# EAGLE schematic ManualBot_Shield (EAGLE 9.2.0)
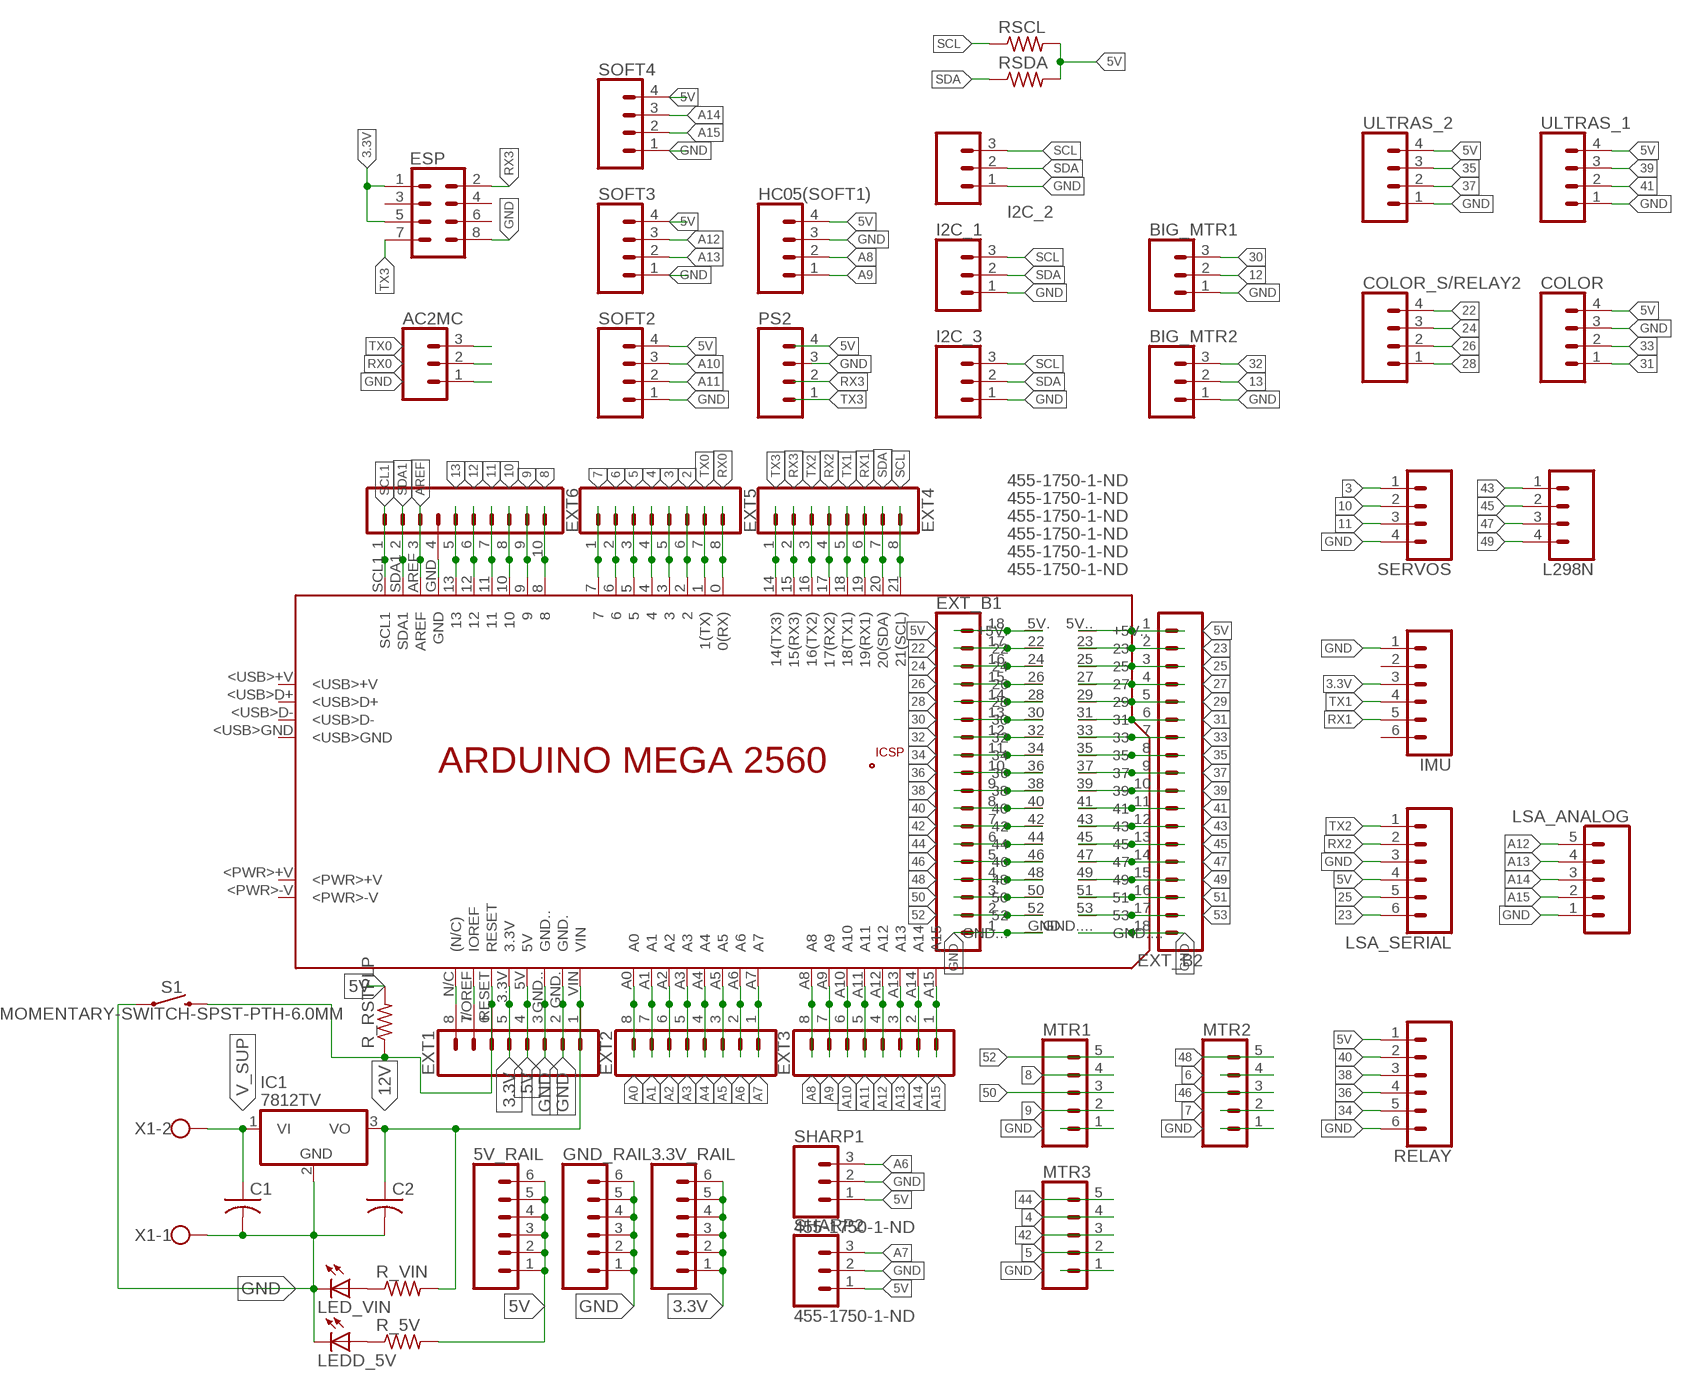
[diagram p0: schematic, sheet 1]

## Parts
3.3V_RAIL  CONN_06SILK_FEMALE_PTH  [1X06]
5V_RAIL  CONN_06SILK_FEMALE_PTH  [1X06]
AC2MC  455-1750-1-ND  CONN_03  [1X03]
BIG_MTR1  455-1750-1-ND  CONN_03  [1X03]
BIG_MTR2  455-1750-1-ND  CONN_03  [1X03]
C1  C-US025-024X044  [C025-024X044]
C2  C-US025-024X044  [C025-024X044]
COLOR  CONN_04  [1X04]
COLOR_S/RELAY2  CONN_04  [1X04]
ESP  CONN_04X2  [2X4]
EXT1  CONN_08"  [1X08]
EXT2  CONN_08"  [1X08]
EXT3  CONN_08"  [1X08]
EXT4  CONN_08"  [1X08]
EXT5  CONN_08"  [1X08]
EXT6  CONN_10"  [1X10]
EXT_B1  CONN_18  [1X18_NO_SILK]
EXT_B2  CONN_18  [1X18_NO_SILK]
GND_RAIL  CONN_06SILK_FEMALE_PTH  [1X06]
HC05(SOFT1)  CONN_04  [1X04]
I2C_1  455-1750-1-ND  CONN_03  [1X03]
I2C_2  455-1750-1-ND  CONN_03  [1X03]
I2C_3  455-1750-1-ND  CONN_03  [1X03]
IC1  7812TV  [TO220V]
IMU  CONN_06SILK_FEMALE_PTH  [1X06]
L298N  CONN_04  [1X04]
LED_VIN  LED5MM  [LED5MM]
LEDD_5V  LED5MM  [LED5MM]
LSA_ANALOG  CONN_05  [1X05]
LSA_SERIAL  CONN_06SILK_FEMALE_PTH  [1X06]
MTR1  CONN_05  [1X05]
MTR2  CONN_05  [1X05]
MTR3  CONN_05  [1X05]
PCB1  ARDUINO_MEGA2560  [ARDUINO_MEGA2560]
PS2  CONN_04  [1X04]
R_5V  R-US_0204/7  [0204/7]
R_RSTPLP  R-US_0204/7  [0204/7]
R_VIN  R-US_0204/7  [0204/7]
RELAY  CONN_06SILK_FEMALE_PTH  [1X06]
RSCL  R-US_0204/7  [0204/7]
RSDA  R-US_0204/7  [0204/7]
S1  MOMENTARY-SWITCH-SPST-PTH-6.0MM  [TACTILE_SWITCH_PTH_6.0MM]
SERVOS  CONN_04  [1X04]
SHARP1  455-1750-1-ND  CONN_03  [1X03]
SHARP2  455-1750-1-ND  CONN_03  [1X03]
SOFT2  CONN_04  [1X04]
SOFT3  CONN_04  [1X04]
SOFT4  CONN_04  [1X04]
ULTRAS_1  CONN_04  [1X04]
ULTRAS_2  CONN_04  [1X04]
X1  W237-102  [W237-102]

## Nets
2: EXT5.6 PCB1.2
3: EXT5.5 PCB1.3 SERVOS.1
3.3V: 3.3V_RAIL.1 3.3V_RAIL.2 3.3V_RAIL.3 3.3V_RAIL.4 3.3V_RAIL.5 3.3V_RAIL.6 ESP.1 ESP.5 EXT1.5 IMU.3 PCB1.3.3V
4: EXT5.4 MTR3.4 PCB1.4
5: EXT5.3 MTR3.2 PCB1.5
5V: 5V_RAIL.1 5V_RAIL.2 5V_RAIL.3 5V_RAIL.4 5V_RAIL.5 5V_RAIL.6 COLOR.4 EXT1.4 EXT_B1.18 EXT_B2.1 HC05(SOFT1).4 LSA_SERIAL.4 PCB1.5V PCB1.5V.(+5V.) PCB1.5V..(+5V..) PS2.4 R_5V.2 R_RSTPLP.2 RELAY.1 RSCL.2 RSDA.2 SHARP1.1 SHARP2.1 SOFT2.4 SOFT3.4 SOFT4.4 ULTRAS_1.4 ULTRAS_2.4
6: EXT5.2 MTR2.4 PCB1.6
7: EXT5.1 MTR2.2 PCB1.7
8: EXT6.10 MTR1.4 PCB1.8
9: EXT6.9 MTR1.2 PCB1.9
10: EXT6.8 PCB1.10 SERVOS.2
11: EXT6.7 PCB1.11 SERVOS.3
12: BIG_MTR1.2 EXT6.6 PCB1.12
12V: C2.1 EXT1.1 IC1.3(VO) PCB1.VIN R_VIN.2
13: BIG_MTR2.2 EXT6.5 PCB1.13
22: COLOR_S/RELAY2.4 EXT_B1.17 PCB1.22
23: EXT_B2.2 LSA_SERIAL.6 PCB1.23
24: COLOR_S/RELAY2.3 EXT_B1.16 PCB1.24
25: EXT_B2.3 LSA_SERIAL.5 PCB1.25
26: COLOR_S/RELAY2.2 EXT_B1.15 PCB1.26
27: EXT_B2.4 PCB1.27
28: COLOR_S/RELAY2.1 EXT_B1.14 PCB1.28
29: EXT_B2.5 PCB1.29
30: BIG_MTR1.3 EXT_B1.13 PCB1.30
31: COLOR.1 EXT_B2.6 PCB1.31
32: BIG_MTR2.3 EXT_B1.12 PCB1.32
33: COLOR.2 EXT_B2.7 PCB1.33
34: EXT_B1.11 PCB1.34 RELAY.5
35: EXT_B2.8 PCB1.35 ULTRAS_2.3
36: EXT_B1.10 PCB1.36 RELAY.4
37: EXT_B2.9 PCB1.37 ULTRAS_2.2
38: EXT_B1.9 PCB1.38 RELAY.3
39: EXT_B2.10 PCB1.39 ULTRAS_1.3
40: EXT_B1.8 PCB1.40 RELAY.2
41: EXT_B2.11 PCB1.41 ULTRAS_1.2
42: EXT_B1.7 MTR3.3 PCB1.42
43: EXT_B2.12 L298N.1 PCB1.43
44: EXT_B1.6 MTR3.5 PCB1.44
45: EXT_B2.13 L298N.2 PCB1.45
46: EXT_B1.5 MTR2.3 PCB1.46
47: EXT_B2.14 L298N.3 PCB1.47
48: EXT_B1.4 MTR2.5 PCB1.48
49: EXT_B2.15 L298N.4 PCB1.49
50: EXT_B1.3 MTR1.3 PCB1.50
51: EXT_B2.16 PCB1.51
52: EXT_B1.2 MTR1.5 PCB1.52
53: EXT_B2.17 PCB1.53
A0: EXT2.8 PCB1.A0
A1: EXT2.7 PCB1.A1
A2: EXT2.6 PCB1.A2
A3: EXT2.5 PCB1.A3
A4: EXT2.4 PCB1.A4
A5: EXT2.3 PCB1.A5
A6: EXT2.2 PCB1.A6 SHARP1.3
A7: EXT2.1 PCB1.A7 SHARP2.3
A8: EXT3.8 HC05(SOFT1).2 PCB1.A8
A9: EXT3.7 HC05(SOFT1).1 PCB1.A9
A10: EXT3.6 PCB1.A10 SOFT2.3
A11: EXT3.5 PCB1.A11 SOFT2.2
A12: EXT3.4 LSA_ANALOG.5 PCB1.A12 SOFT3.3
A13: EXT3.3 LSA_ANALOG.4 PCB1.A13 SOFT3.2
A14: EXT3.2 LSA_ANALOG.3 PCB1.A14 SOFT4.3
A15: EXT3.1 LSA_ANALOG.2 PCB1.A15 SOFT4.2
AREF: EXT6.3 PCB1.AREF
GND: AC2MC.1 BIG_MTR1.1 BIG_MTR2.1 C1.2 C2.2 COLOR.3 ESP.8 EXT1.2 EXT1.3 EXT6.4 EXT_B1.1 EXT_B2.18 GND_RAIL.1 GND_RAIL.2 GND_RAIL.3 GND_RAIL.4 GND_RAIL.5 GND_RAIL.6 HC05(SOFT1).3 I2C_1.1 I2C_2.1 I2C_3.1 IC1.2(GND) IMU.1 LED_VIN.K(C) LEDD_5V.K(C) LSA_ANALOG.1 LSA_SERIAL.3 MTR1.1 MTR2.1 MTR3.1 PCB1.GND PCB1.GND. PCB1.GND.. PCB1.GND... PCB1.GND.... PS2.3 RELAY.6 S1.1 SERVOS.4 SHARP1.2 SHARP2.2 SOFT2.1 SOFT3.1 SOFT4.1 ULTRAS_1.1 ULTRAS_2.1 X1.1
N$4: LED_VIN.A R_VIN.1
N$5: LEDD_5V.A R_5V.1
N$55: EXT1.6 PCB1.RESET R_RSTPLP.1 S1.3
N$61: EXT1.7 PCB1.I/OREF(IOREF)
N$62: EXT1.8 PCB1.N/C((N/C))
RX0: AC2MC.2 EXT5.8 PCB1.0(0(RX))
RX1: EXT4.6 IMU.5 PCB1.19(19(RX1))
RX2: EXT4.4 LSA_SERIAL.2 PCB1.17(17(RX2))
RX3: ESP.2 EXT4.2 PCB1.15(15(RX3)) PS2.2
SCL: EXT4.8 I2C_1.3 I2C_2.3 I2C_3.3 PCB1.21(21(SCL)) RSCL.1
SCL1: EXT6.1 PCB1.SCL1
SDA: EXT4.7 I2C_1.2 I2C_2.2 I2C_3.2 PCB1.20(20(SDA)) RSDA.1
SDA1: EXT6.2 PCB1.SDA1
TX0: AC2MC.3 EXT5.7 PCB1.1(1(TX))
TX1: EXT4.5 IMU.4 PCB1.18(18(TX1))
TX2: EXT4.3 LSA_SERIAL.1 PCB1.16(16(TX2))
TX3: ESP.7 EXT4.1 PCB1.14(14(TX3)) PS2.1
V_SUP: C1.1 IC1.1(VI) X1.2
Unconnected: ESP.3 ESP.4 ESP.6 IMU.2 IMU.6 PCB1.+5V_ PCB1.<PWR>+V PCB1.<PWR>-V PCB1.<USB>+V PCB1.<USB>D+ PCB1.<USB>D- PCB1.<USB>GND PCB1.GND__ PCB1.MISO PCB1.MOSI PCB1.RESET. PCB1.SCK

## Library data of the parts
3.3V_RAIL 5V_RAIL GND_RAIL IMU LSA_SERIAL RELAY = SparkFun-Connectors:CONN_06: Multi connection point. Often used as Generic Header-pin footprint for 0.1 inch spaced/style header connections On any of the 0.1 inch spaced packages, you can populate with these: Break Away Headers - Straight <https://www.sparkfun.com/products/116> (PRT-00116) Break Away Male Headers - Right Angle <https://www.sparkfun.com/products/553> (PRT-00553) Female Headers <https://www.sparkfun.com/products/115> (PRT-00115) Break Away Headers - Machine Pin <https://www.sparkfun.com/products/117> (PRT-00117) Break Away Female Headers - Swiss Machine Pin <https://www.sparkfun.com/products/743> (PRT-00743) Arduino Stackable Header - 6 Pin <https://www.sparkfun.com/products/9280> (PRT-09280) For SCREWTERMINALS and SPRING TERMINALS visit here: Screw Terimnals on SparkFun.com <https://www.sparkfun.com/search/results?term=Screw+Terminals> (5mm/3.5mm/2.54mm spacing) This device is also useful as a general connection point to wire up your design to another part of your project. Our various solder wires solder well into these plated through hole pads. Hook-Up Wire - Assortment (Stranded, 22 AWG) <https://www.sparkfun.com/products/11375> (PRT-11375) Hook-Up Wire - Assortment (Solid Core, 22 AWG) <https://www.sparkfun.com/products/11367> (PRT-11367) View the entire wire category on our website here <https://www.sparkfun.com/categories/141>; PROD_ID: CONN-08437
AC2MC BIG_MTR1 BIG_MTR2 I2C_1-I2C_3 SHARP1 SHARP2 = SparkFun-Connectors:CONN_03: Multi connection point. Often used as Generic Header-pin footprint for 0.1 inch spaced/style header connections On any of the 0.1 inch spaced packages, you can populate with these: Break Away Headers - Straight <https://www.sparkfun.com/products/116> (PRT-00116) Break Away Male Headers - Right Angle <https://www.sparkfun.com/products/553> (PRT-00553) Female Headers <https://www.sparkfun.com/products/115> (PRT-00115) Break Away Headers - Machine Pin <https://www.sparkfun.com/products/117> (PRT-00117) Break Away Female Headers - Swiss Machine Pin <https://www.sparkfun.com/products/743> (PRT-00743) Stackable Header - 3 Pin (Female, 0.1") <https://www.sparkfun.com/products/13875> (PRT-13875) For SCREWTERMINALS and SPRING TERMINALS visit here: Screw Terimnals on SparkFun.com <https://www.sparkfun.com/search/results?term=Screw+Terminals> (5mm/3.5mm/2.54mm spacing) This device is also useful as a general connection point to wire up your design to another part of your project. Our various solder wires solder well into these plated through hole pads. Hook-Up Wire - Assortment (Stranded, 22 AWG) <https://www.sparkfun.com/products/11375> (PRT-11375) Hook-Up Wire - Assortment (Solid Core, 22 AWG) <https://www.sparkfun.com/products/11367> (PRT-11367) View the entire wire category on our website here <https://www.sparkfun.com/categories/141> Special notes: Molex polarized connector foot print use with SKU : PRT-08232 with associated crimp pins and housings.; PROD_ID: XXX-00000
C1 C2 = adafruit:C-US: CAPACITOR, American symbol
COLOR COLOR_S/RELAY2 HC05(SOFT1) L298N PS2 SERVOS SOFT2-SOFT4 ULTRAS_1 ULTRAS_2 = SparkFun-Connectors:CONN_04: Multi connection point. Often used as Generic Header-pin footprint for 0.1 inch spaced/style header connections On any of the 0.1 inch spaced packages, you can populate with these: Break Away Headers - Straight <https://www.sparkfun.com/products/116> (PRT-00116) Break Away Male Headers - Right Angle <https://www.sparkfun.com/products/553> (PRT-00553) Female Headers <https://www.sparkfun.com/products/115> (PRT-00115) Break Away Headers - Machine Pin <https://www.sparkfun.com/products/117> (PRT-00117) Break Away Female Headers - Swiss Machine Pin <https://www.sparkfun.com/products/743> (PRT-00743) For SCREWTERMINALS and SPRING TERMINALS visit here: Screw Terimnals on SparkFun.com <https://www.sparkfun.com/search/results?term=Screw+Terminals> (5mm/3.5mm/2.54mm spacing) This device is also useful as a general connection point to wire up your design to another part of your project. Our various solder wires solder well into these plated through hole pads. Hook-Up Wire - Assortment (Stranded, 22 AWG) <https://www.sparkfun.com/products/11375> (PRT-11375) Hook-Up Wire - Assortment (Solid Core, 22 AWG) <https://www.sparkfun.com/products/11367> (PRT-11367) View the entire wire category on our website here <https://www.sparkfun.com/categories/141> Special notes: Molex polarized connector foot print use with SKU : PRT-08231 with associated crimp pins and housings. 1MM SMD Version SKU: PRT-10208; PROD_ID: CONN-09696
ESP = SparkFun-Connectors:CONN_04X2: Multi connection point. Often used as Generic Header-pin footprint for 0.1 inch spaced/style header connections On any of the 0.1 inch spaced packages, you can populate with these: Break Away Headers - Straight <https://www.sparkfun.com/products/116> (PRT-00116) Break Away Male Headers - Right Angle <https://www.sparkfun.com/products/553> (PRT-00553) Female Headers <https://www.sparkfun.com/products/115> (PRT-00115) Break Away Headers - Machine Pin <https://www.sparkfun.com/products/117> (PRT-00117) Break Away Female Headers - Swiss Machine Pin <https://www.sparkfun.com/products/743> (PRT-00743)
EXT1-EXT5 = SparkFun-Connectors:CONN_08: Multi connection point. Often used as Generic Header-pin footprint for 0.1 inch spaced/style header connections On any of the 0.1 inch spaced packages, you can populate with these: Break Away Headers - Straight <https://www.sparkfun.com/products/116> (PRT-00116) Break Away Male Headers - Right Angle <https://www.sparkfun.com/products/553> (PRT-00553) Female Headers <https://www.sparkfun.com/products/115> (PRT-00115) Break Away Headers - Machine Pin <https://www.sparkfun.com/products/117> (PRT-00117) Break Away Female Headers - Swiss Machine Pin <https://www.sparkfun.com/products/743> (PRT-00743) Arduino Stackable Header - 8 Pin <https://www.sparkfun.com/products/9279> (PRT-09279) For SCREWTERMINALS and SPRING TERMINALS visit here: Screw Terimnals on SparkFun.com <https://www.sparkfun.com/search/results?term=Screw+Terminals> (5mm/3.5mm/2.54mm spacing) This device is also useful as a general connection point to wire up your design to another part of your project. Our various solder wires solder well into these plated through hole pads. Hook-Up Wire - Assortment (Stranded, 22 AWG) <https://www.sparkfun.com/products/11375> (PRT-11375) Hook-Up Wire - Assortment (Solid Core, 22 AWG) <https://www.sparkfun.com/products/11367> (PRT-11367) View the entire wire category on our website here <https://www.sparkfun.com/categories/141> Special notes: Molex polarized connector foot print use with SKU : PRT-08231 with associated crimp pins and housings. 1MM SMD Version SKU: PRT-10208 NOTES ON THE VARIANTS LOCK and LOCK_LONGPADS... This footprint was designed to help hold the alignment of a through-hole component (i.e. 6-pin header) while soldering it into place. You may notice that each hole has been shifted either up or down by 0.005 of an inch from it's more standard position (which is a perfectly straight line). This slight alteration caused the pins (the squares in the middle) to touch the edges of the holes. Because they are alternating, it causes a "brace" to hold the component in place. 0.005 has proven to be the perfect amount of "off-center" position when using our standard breakaway headers. Although looks a little odd when you look at the bare footprint, once you have a header in there, the alteration is very hard to notice. Also,if you push a header all the way into place, it is covered up entirely on the bottom side.; PROD_ID: CONN-08438
EXT6 = SparkFun-Connectors:CONN_10: Multi connection point. Often used as Generic Header-pin footprint for 0.1 inch spaced/style header connections On any of the 0.1 inch spaced packages, you can populate with these: Break Away Headers - Straight <https://www.sparkfun.com/products/116> (PRT-00116) Break Away Male Headers - Right Angle <https://www.sparkfun.com/products/553> (PRT-00553) Female Headers <https://www.sparkfun.com/products/115> (PRT-00115) Break Away Headers - Machine Pin <https://www.sparkfun.com/products/117> (PRT-00117) Break Away Female Headers - Swiss Machine Pin <https://www.sparkfun.com/products/743> (PRT-00743) Arduino Stackable Header - 10 Pin <https://www.sparkfun.com/products/11376> (PRT-11376) For SCREWTERMINALS and SPRING TERMINALS visit here: Screw Terimnals on SparkFun.com <https://www.sparkfun.com/search/results?term=Screw+Terminals> (5mm/3.5mm/2.54mm spacing) This device is also useful as a general connection point to wire up your design to another part of your project. Our various solder wires solder well into these plated through hole pads. Hook-Up Wire - Assortment (Stranded, 22 AWG) <https://www.sparkfun.com/products/11375> (PRT-11375) Hook-Up Wire - Assortment (Solid Core, 22 AWG) <https://www.sparkfun.com/products/11367> (PRT-11367) View the entire wire category on our website here <https://www.sparkfun.com/categories/141> Special notes: Molex polarized connector foot print use with SKU : PRT-08231 with associated crimp pins and housings. 1MM SMD Version SKU: PRT-10208 NOTES ON THE VARIANTS LOCK and LOCK_LONGPADS... This footprint was designed to help hold the alignment of a through-hole component (i.e. 6-pin header) while soldering it into place. You may notice that each hole has been shifted either up or down by 0.005 of an inch from it's more standard position (which is a perfectly straight line). This slight alteration caused the pins (the squares in the middle) to touch the edges of the holes. Because they are alternating, it causes a "brace" to hold the component in place. 0.005 has proven to be the perfect amount of "off-center" position when using our standard breakaway headers. Although looks a little odd when you look at the bare footprint, once you have a header in there, the alteration is very hard to notice. Also,if you push a header all the way into place, it is covered up entirely on the bottom side.; PROD_ID: CONN-11563
EXT_B1 EXT_B2 = SparkFun-Connectors:CONN_18: Multi connection point. Often used as Generic Header-pin footprint for 0.1 inch spaced/style header connections On any of the 0.1 inch spaced packages, you can populate with these: Break Away Headers - Straight <https://www.sparkfun.com/products/116> (PRT-00116) Break Away Male Headers - Right Angle <https://www.sparkfun.com/products/553> (PRT-00553) Female Headers <https://www.sparkfun.com/products/115> (PRT-00115) Break Away Headers - Machine Pin <https://www.sparkfun.com/products/117> (PRT-00117) Break Away Female Headers - Swiss Machine Pin <https://www.sparkfun.com/products/743> (PRT-00743) For SCREWTERMINALS and SPRING TERMINALS visit here: Screw Terimnals on SparkFun.com <https://www.sparkfun.com/search/results?term=Screw+Terminals> (5mm/3.5mm/2.54mm spacing) This device is also useful as a general connection point to wire up your design to another part of your project. Our various solder wires solder well into these plated through hole pads. Hook-Up Wire - Assortment (Stranded, 22 AWG) <https://www.sparkfun.com/products/11375> (PRT-11375) Hook-Up Wire - Assortment (Solid Core, 22 AWG) <https://www.sparkfun.com/products/11367> (PRT-11367) View the entire wire category on our website here <https://www.sparkfun.com/categories/141> Special notes: Molex polarized connector foot print use with SKU : PRT-08231 with associated crimp pins and housings. 1MM SMD Version SKU: PRT-10208 NOTES ON THE VARIANTS LOCK and LOCK_LONGPADS... This footprint was designed to help hold the alignment of a through-hole component (i.e. 6-pin header) while soldering it into place. You may notice that each hole has been shifted either up or down by 0.005 of an inch from it's more standard position (which is a perfectly straight line). This slight alteration caused the pins (the squares in the middle) to touch the edges of the holes. Because they are alternating, it causes a "brace" to hold the component in place. 0.005 has proven to be the perfect amount of "off-center" position when using our standard breakaway headers. Although looks a little odd when you look at the bare footprint, once you have a header in there, the alteration is very hard to notice. Also,if you push a header all the way into place, it is covered up entirely on the bottom side.
IC1 = linear:78*: Positive VOLTAGE REGULATOR Source: http://cache.national.com/ds/LM/LM78L05.pdf http://www.fairchildsemi.com/ds/LM/LM7805.pdf
LED_VIN LEDD_5V = adafruit:LED: LED OSRAM: - CHIPLED LG R971, LG N971, LY N971, LG Q971, LY Q971, LO R971, LY R971 LH N974, LH R974 LS Q976, LO Q976, LY Q976 LO Q996 - Hyper CHIPLED LW Q18S LB Q993, LB Q99A, LB R99A - SideLED LS A670, LO A670, LY A670, LG A670, LP A670 LB A673, LV A673, LT A673, LW A673 LH A674 LY A675 LS A676, LA A676, LO A676, LY A676, LW A676 LS A679, LY A679, LG A679 - Hyper Micro SIDELED® LS Y876, LA Y876, LO Y876, LY Y876 LT Y87S - SmartLED LW L88C, LW L88S LB L89C, LB L89S, LG L890 LS L89K, LO L89K, LY L89K LS L896, LA L896, LO L896, LY L896 - TOPLED LS T670, LO T670, LY T670, LG T670, LP T670 LSG T670, LSP T670, LSY T670, LOP T670, LYG T670 LG T671, LOG T671, LSG T671 LB T673, LV T673, LT T673, LW T673 LH T674 LS T676, LA T676, LO T676, LY T676, LB T676, LH T676, LSB T676, LW T676 LB T67C, LV T67C, LT T67C, LS T67K, LO T67K, LY T67K, LW E67C LS E67B, LA E67B, LO E67B, LY E67B, LB E67C, LV E67C, LT E67C LW T67C LS T679, LY T679, LG T679 LS T770, LO T770, LY T770, LG T770, LP T770 LB T773, LV T773, LT T773, LW T773 LH T774 LS E675, LA E675, LY E675, LS T675 LS T776, LA T776, LO T776, LY T776, LB T776 LHGB T686 LT T68C, LB T68C - Hyper Mini TOPLED® LB M676 - Mini TOPLED Santana® LG M470 LS M47K, LO M47K, LY M47K Source: http://www.osram.convergy.de/
LSA_ANALOG MTR1-MTR3 = SparkFun-Connectors:CONN_05: Multi connection point. Often used as Generic Header-pin footprint for 0.1 inch spaced/style header connections On any of the 0.1 inch spaced packages, you can populate with these: Break Away Headers - Straight <https://www.sparkfun.com/products/116> (PRT-00116) Break Away Male Headers - Right Angle <https://www.sparkfun.com/products/553> (PRT-00553) Female Headers <https://www.sparkfun.com/products/115> (PRT-00115) Break Away Headers - Machine Pin <https://www.sparkfun.com/products/117> (PRT-00117) Break Away Female Headers - Swiss Machine Pin <https://www.sparkfun.com/products/743> (PRT-00743) For SCREWTERMINALS and SPRING TERMINALS visit here: Screw Terimnals on SparkFun.com <https://www.sparkfun.com/search/results?term=Screw+Terminals> (5mm/3.5mm/2.54mm spacing) This device is also useful as a general connection point to wire up your design to another part of your project. Our various solder wires solder well into these plated through hole pads. Hook-Up Wire - Assortment (Stranded, 22 AWG) <https://www.sparkfun.com/products/11375> (PRT-11375) Hook-Up Wire - Assortment (Solid Core, 22 AWG) <https://www.sparkfun.com/products/11367> (PRT-11367) View the entire wire category on our website here <https://www.sparkfun.com/categories/141> Special notes: Molex polarized connector foot print use with SKU : PRT-08231 with associated crimp pins and housings. 1MM SMD Version SKU: PRT-10208
PCB1 = E14_Arduino_revC:ARDUINO_MEGA2560: Device for representing an Arduino Mega 2560 board with a footprint in an EAGLE design. Created by Dave Young for Element14. More EAGLE documentation at: http://www.element14.com/community/community/knode/cadsoft_eagle
R_5V R_RSTPLP R_VIN RSCL RSDA = adafruit:R-US_: RESISTOR, American symbol
S1 = SparkFun-Switches:MOMENTARY-SWITCH-SPST: Momentary Switch (Pushbutton) - SPST Normally-open (NO) SPST momentary switches (buttons, pushbuttons). Variants PTH-12MM - 12mm square, through-hole Momentary Pushbutton Switch - 12mm Square <https://www.sparkfun.com/products/9190> (COM-09190) PTH-6.0MM, PTH-6.0MM-KIT - 6.0mm square, through-hole Mini Pushbutton Switch <https://www.sparkfun.com/products/97> (COM-00097) KIT package intended for soldering kit's - only one side of pads' copper is exposed. PTH-RIGHT-ANGLE-KIT - Right-angle, through-hole Right Angle Tactile Button <https://www.sparkfun.com/products/10791> - Used on SparkFun BigTime Watch Kit <https://www.sparkfun.com/products/11734> SMD-12MM - 12mm square, surface-mount Tactile Button - SMD (12mm) <https://www.sparkfun.com/products/12993> (COM-12993) Used on SparkFun PicoBoard <https://www.sparkfun.com/products/11888> SMD-4.5MM - 4.5mm Square Trackball Switch Used on SparkFun Blackberry Trackballer Breakout <https://www.sparkfun.com/products/13169> SMD-4.6MMX2.8MM - 4.60mm x 2.80mm, surface mount Used on SparkFun SAMD21 Mini Breakout <https://www.sparkfun.com/products/13664> SMD-5.2MM, SMD-5.2-REDUNDANT - 5.2mm square, surface-mount Mini Pushbutton Switch - SMD <https://www.sparkfun.com/products/8720> (COM-08720) Used on Arduino Pro Mini <https://www.sparkfun.com/products/11114> REDUNDANT package connects both switch circuits together SMD-6.0X3.5MM - 6.0 x 3.5mm, surface mount Momentary Reset Switch SMD <https://www.sparkfun.com/products/8229> (COM-08229) SMD-6.2MM-TALL - 6.2mm square, surface mount Tactile Button - SMD (6mm) <https://www.sparkfun.com/products/12992> Used on SparkFun Digital Sandbox <https://www.sparkfun.com/products/12651> SMD-RIGHT-ANGLE - Right-angle, surface mount Used on SparkFun Block for Intel® Edison - Arduino <https://www.sparkfun.com/products/13036>; PROD_ID: SWCH-08441; SF_SKU: COM-00097
X1 = con-wago-500:W237-102: WAGO SCREW CLAMP; MPN: 237-102; OC_FARNELL: unknown; OC_NEWARK: 70K9898